# Altium schematic sheet OLED096.SchDoc
size A4
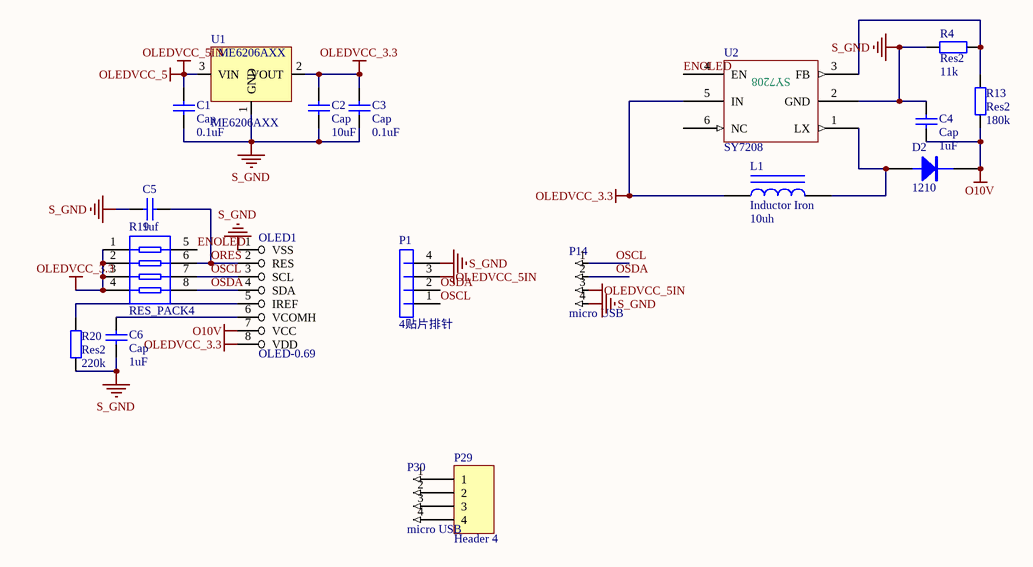
[diagram p0: OLED096.SchDoc]

## Parts
C1  Cap  value 0.1uF  [6-0805]
C2  Cap  value 10uF  [6-0805]
C3  Cap  value 0.1uF  [6-0805]
C4  Cap  value 1uF  [LC-0603_C]
C5  value 1uf  [LC-0603_C]  (hidden comment: Cap)
C6  Cap  value 1uF  [LC-0603_C]
D2  1210  [LC-1206_L]
L1  Inductor Iron  value 10uh  [LC-0805_L]
OLED1  OLED-0.69  [OLED-0.69]
P1  4贴片排针  [4针贴片接头2.0]
P14  micro USB  [1.0MM 翻盖 下接 FPC连接器 4P]
P29  Header 4  [HDR1X4]
P30  micro USB  [1.0MM 翻盖 下接 FPC连接器 4P]
R4  Res2  value 11k  [LC-0603_R]
R13  Res2  value 180k  [LC-0603_R]
R19  RES_PACK4  [RES4]
R20  Res2  value 220k  [LC-0603_R]
U1  ME6206AXX  [sot23]
U2  SY7208  [LC-SOT-23-6]

## Nets
O10V: C4.1 D2.K OLED1.7(VCC) R13.1
OLEDVCC_3.3: C2.1 C3.1 L1.1 OLED1.8(VDD) R19.1 R19.2 R19.3 R19.4 U1.2(VOUT) U2.5(IN)
OLEDVCC_5: C1.1 P1.3 P14.3 U1.3(VIN)  [also labelled OLEDVCC_5IN]
S_GND: C1.2 C2.2 C3.2 C4.2 C5.1 C6.2 OLED1.1(VSS) P1.4 P14.4 R4.2 R20.1 U1.1(GND) U2.2(GND)
ENOLED: R19.5 U2.4(EN)
ORES: C5.2 OLED1.2(RES) R19.6
OSCL: OLED1.3(SCL) P1.1 P14.1 R19.7
OSDA: OLED1.4(SDA) P1.2 P14.2 R19.8
NetC6_1: C6.1 OLED1.6(VCOMH)
NetD2_A: D2.A L1.2 U2.1(LX)
NetOLED1_5: OLED1.5(IREF) R20.2
NetP29_1: P29.1 P30.1
NetP29_2: P29.2 P30.2
NetP29_3: P29.3 P30.3
NetP29_4: P29.4 P30.4
NetR4_1: R4.1 R13.2 U2.3(FB)

Not connected (* = marked no-connect by the designer): U2 6(NC)

## Library data of the parts
C1-C6 = Cap: Capacitor; Published: 8-Jun-2000; LatestRevisionDate: 17-Jul-2002; LatestRevisionNote: Re-released for DXP Platform.; PackageReference: RAD-0.3; Publisher: Altium Limited
D2 = 1N4001: pin to pad: A>1 K>2
L1 = Inductor Iron: Magnetic-Core Inductor; Published: 24-Mar-1999; LatestRevisionDate: 17-Jul-2002; LatestRevisionNote: Re-released for DXP Platform.; PackageReference: AXIAL-0.9; Publisher: Altium Limited
OLED1 = OLED-0.69: pin to pad: 1>8 2>7 3>6 4>5 5>4 6>3 7>2 8>1
P14 P30 = FPC 4P 1MM
P29 = Header 4: Header, 4-Pin; LatestRevisionDate: 17-Jul-2002; LatestRevisionNote: Re-released for DXP Platform.; Publisher: Altium Limited
R4 R13 R20 = Res2: Resistor; Published: 8-Jun-2000; LatestRevisionDate: 17-Jul-2002; LatestRevisionNote: Re-released for DXP Platform.; PackageReference: AXIAL-0.4; Publisher: Altium Limited
U1 = ME6206AXX: pin to pad: 1>3 3>1